# Altium schematic sheet Mother_board_power.SchDoc
size 209 x 297 mm; PageSetup: Record=PageOptions|CenterHorizontal=True|CenterVertical=True|PrintScale=1.00|XCorrection=1.00|YCorrection=1.00|PrintKind=1|BorderSize=5000000|LeftOffset=0|BottomOffset=0|Orientation=2|PaperLength=1000|PaperWidth=1000|Scale=100|PaperSource=15|PrintQuality=1200|MediaType=1|DitherType=10|PaperKind=A3|PrintScaleMode=1; Weight: -; ScaleFactor: -; NormInspection: Норм.Контр.
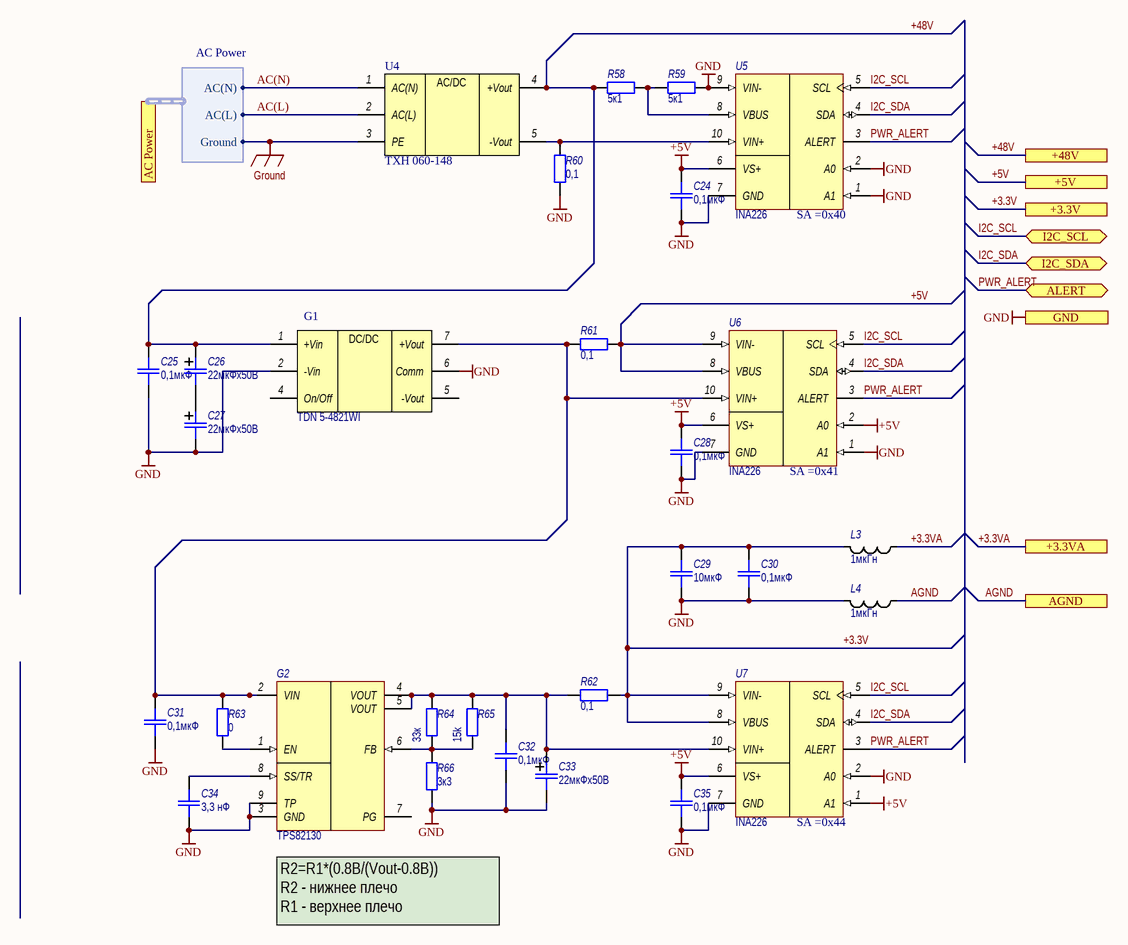
[diagram p0: Mother_board_power.SchDoc]

## Parts
C24  0,1мкФ  [SMD_0805]
C25  0,1мкФ  [SMD_0805]
C26  22мкФх50В  [SMD_size_B]
C27  22мкФх50В  [SMD_size_B]
C28  0,1мкФ  [SMD_0805]
C29  10мкФ  [SMD_0805]
C30  0,1мкФ  [SMD_0805]
C31  0,1мкФ  [SMD_0805]
C32  0,1мкФ  [SMD_0805]
C33  22мкФх50В  [SMD_size_B]
C34  3,3 нФ  [SMD_0805]
C35  0,1мкФ  [SMD_0805]
G1  Наименование: TDN 5-4821WI  [TDN_5_WISM]  (hidden comment: TDN 5-4821)
G2  TPS82130  [uSiL-8]
L3  1мкГн  [SMD_0805]
L4  1мкГн  [SMD_0805]
R58  5к1  [SMD_0805]
R59  5к1  [SMD_0805]
R60  0,1  [SMD_0805]
R61  0,1  [SMD_0805]
R62  0,1  [SMD_0805]
R63  0  [SMD_0805]
R64  33к  [SMD_0805]
R65  15k  [SMD_0805]
R66  3к3  [SMD_0805]
U4  TXH 060-148  [TXH 060-148 (2)]
U5  Adress: SA =0x40  [VSSOP-10]  (hidden comment: INA226)
U6  Adress: SA =0x41  [VSSOP-10]  (hidden comment: INA226)
U7  Adress: SA =0x44  [VSSOP-10]  (hidden comment: INA226)

## Ports
+3.3V, +3.3VA, +5V, +48V, AC Power (harness AC Power), AGND, ALERT (bidir), GND, I2C_SCL (bidir), I2C_SDA (bidir)

## Harnesses
AC Power: AC(N), AC(L), Ground

## Nets
+5V: C24.2 C28.2 C35.2 R61.2 U5.6(VS+) U6.2(A0) U6.6(VS+) U6.8(VBUS) U6.9(VIN-) U7.1(A1) U7.6(VS+) ; port +5V
GND: C24.1 C25.1 C27.2 C28.1 C29.1 C30.1 C31.1 C32.1 C33.2 C34.1 C35.1 G1.2(-Vin) G1.6(Comm) G2.3(GND) G2.9(TP) L4.2 R59.2 R60.1 R66.2 U5.1(A1) U5.2(A0) U5.7(GND) U5.9(VIN-) U6.1(A1) U6.7(GND) U7.2(A0) U7.7(GND) ; port GND
Ground: U4.3(PE) ; port AC Power.Ground
+3.3V: C29.2 C30.2 L3.2 R62.2 U7.8(VBUS) U7.9(VIN-) ; port +3.3V
+3.3VA: L3.1 ; port +3.3VA
+48V: C25.2 C26.1 G1.1(+Vin) R58.1 U4.4(+Vout) ; port +48V
AC(L): U4.2(AC(L)) ; port AC Power.AC(L)
AC(N): U4.1(AC(N)) ; port AC Power.AC(N)
AGND: L4.1 ; port AGND
I2C_SCL: U5.5(SCL) U6.5(SCL) U7.5(SCL) ; port I2C_SCL
I2C_SDA: U5.4(SDA) U6.4(SDA) U7.4(SDA) ; port I2C_SDA
PWR_ALERT: U5.3(ALERT) U6.3(ALERT) U7.3(ALERT) ; port ALERT
NetC26_2: C26.2 C27.1
NetC31_2: C31.2 G1.7(+Vout) G2.2(VIN) R61.1 R63.2 U6.10(VIN+)
NetC32_2: C32.2 C33.1 G2.4(VOUT) G2.5(VOUT) R62.1 R64.1 R65.1 U7.10(VIN+)
NetC34_2: C34.2 G2.8(SS/TR)
NetG2_1: G2.1(EN) R63.1
NetG2_6: G2.6(FB) R64.2 R65.2 R66.1
NetR58_2: R58.2 R59.1 U5.8(VBUS)
NetR60_2: R60.2 U4.5(-Vout) U5.10(VIN+)

Not connected (* = marked no-connect by the designer): G1 4(On/Off) 5(-Vout); G2 7(PG)

## Notes on the sheet
- (near G2) R2=R1*(0.8В/(Vout-0.8B))
  R2 - нижнее плечо
  R1 - верхнее плечо
- Перв. примен.
- Справ. №
- Подп. и дата
- Инв. № дубл.
- Взам. инв. №
- Разраб.
- Изм.
- Лист
- № докум.
- Подп.
- Дата
- Литера
- Масса
- Масштаб
- Пров.
- Т.контр.
- Листов
- Инв. № подл.
- Н.контр.
- Утв.
- Форма 1 ГОСТ 2.104-2006
- Копировал
- Формат А4
- (in symbol TEN5 2411) DC/DC
- (in symbol TXH 060-148) AC/DC

## Library data of the parts
C24 C25 C28-C32 C34 C35 = Capacitor: Назначение: SMD-конденсатор; Наименование: Конденсатор; Потребление, Вт: 0
  C24 C25 C28 C30-C32 C35: Value: 0,1мкФ
  C29: Value: 10мкФ
  C34: Value: 3,3 нФ
C26 C27 C33 = Capacitor_pol: Polarized capacitor; Назначение: Поляризованный SMD-конденсатор; Наименование: Поляризованный конденсатор; Потребление, Вт: 0; Value: 22мкФх50В
G1 = TEN5 2411: DC/DC converter; Назначение: DC-DC преобразователь; Потребление, Вт: 0,01; DataSheet: https://www.tracopower.com/sites/default/files/products/datasheets/tdn5wi_datasheet.pdf
G2 = TPS82130: 17-V Input 3-A Step-Down Converter MicroSiP™ Module with Integrated Inductor; Потребление, Вт: 1,0; ComponentLink1Description: Data sheet; ComponentLink1URL: http://www.ti.com/lit/ds/symlink/tps82130.pdf; Назначение: 17-V Input 3-A Step-Down Converter MicroSiP™ Module with Integrated Inductor; DataSheet: https://www.ti.com/lit/ds/symlink/tps82130.pdf?ts=1592813288219&ref_url=https%253A%252F%252Fwww.google.com%252F; Наименование: TPS82130
L3 L4 = Inductor: Наименование: Индуктивность; Назначение: SMD-индуктивность; Потребление, Вт: 0,010; Value: 1мкГн
R58-R66 = Resistor: Наименование: Резистор; Назначение: SMD-резистор; Потребление, Вт: 0,001
  R58 R59: Value: 5к1
  R60-R62: Value: 0,1
  R63: Value: 0
  R64: Value: 33к
  R65: Value: 15k
  R66: Value: 3к3
U4 = TXH 060-148: AC/DC Power Supply; Назначение: AC-DC преобразователь; Потребление, Вт: 60; Наименование: TXH 060-148
U5-U7 = INA226: High- or Low-Side Measurement, Bidirectional Current and Power Monitor With I2C Interface; Назначение: High-Side or Low-Side Measurement,; Потребление, Вт: 0,001; ComponentLink1Description: Data sheet; ComponentLink1URL: http://www.ti.com/lit/ds/symlink/ina226.pdf; DataSheet: https://www.ti.com/lit/ds/symlink/ina226.pdf?ts=1592809211957&ref_url=https%253A%252F%252Fwww.google.com%252F; Наименование: INA226